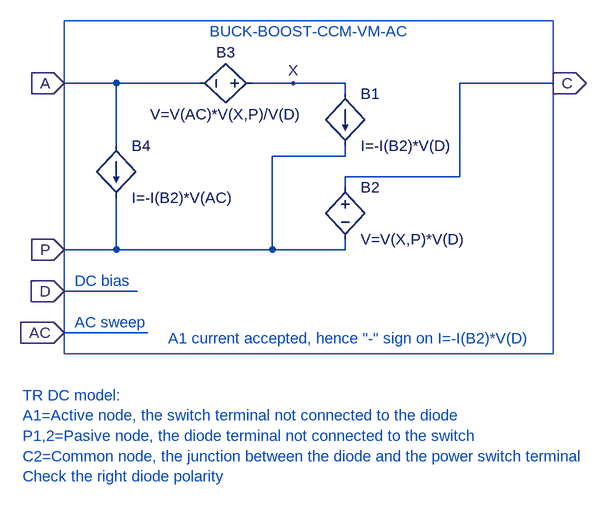
[diagram p0: schematic BUCK-BOOST-CCM-VM-AC.asc]
BUCK-BOOST-CCM-VM-AC.asc, the LTspice schematic file:
Version 4
SHEET 1 928 680
WIRE 96 -144 16 -144
WIRE 224 -144 96 -144
WIRE 368 -144 304 -144
WIRE 448 -144 368 -144
WIRE 768 -144 624 -144
WIRE 448 -128 448 -144
WIRE 96 -48 96 -144
WIRE 448 -32 448 -48
WIRE 448 -32 336 -32
WIRE 624 0 624 -144
WIRE 624 0 448 0
WIRE 448 16 448 0
WIRE 96 112 96 32
WIRE 96 112 16 112
WIRE 336 112 336 -32
WIRE 336 112 96 112
WIRE 448 112 448 96
WIRE 448 112 336 112
WIRE 128 176 16 176
WIRE 144 240 16 240
FLAG 16 -144 A
IOPIN 16 -144 In
FLAG 16 112 P
IOPIN 16 112 In
FLAG 768 -144 C
IOPIN 768 -144 Out
FLAG 16 176 D
IOPIN 16 176 In
FLAG 16 240 AC
IOPIN 16 240 In
FLAG 368 -144 X
SYMBOL bi 448 -128 R0
SYMATTR InstName B1
SYMATTR Value I=-I(B2)*V(D)
SYMBOL bv 448 0 R0
SYMATTR InstName B2
SYMATTR Value V=V(X,P)*V(D)
SYMBOL bv 320 -144 R90
WINDOW 0 -32 56 VBottom 0
WINDOW 3 32 56 VTop 0
SYMATTR InstName B3
SYMATTR Value V=V(AC)*V(X,P)/V(D)
SYMBOL bi 96 -48 R0
SYMATTR InstName B4
SYMATTR Value I=-I(B2)*V(AC)
TEXT 240 -224 Left 0 ;BUCK-BOOST-CCM-VM-AC
TEXT -48 336 Left 0 ;TR DC model:\nA1=Active node, the switch terminal not connected to the diode\nP1,2=Pasive node, the diode terminal not connected to the switch\nC2=Common node, the junction between the diode and the power switch terminal\nCheck the right diode polarity
TEXT 176 248 Left 0 ;A1 current accepted, hence "-" sign on I=-I(B2)*V(D)
TEXT 32 224 Left 0 ;AC sweep
TEXT 32 160 Left 0 ;DC bias
RECTANGLE Normal 768 272 16 -240

The netlist it stands for:
* BUCK-BOOST-CCM-VM-AC.asc
B1 X P I=-I(B2)*V(D)
B2 C P V=V(X,P)*V(D)
B3 X A V=V(AC)*V(X,P)/V(D)
B4 A P I=-I(B2)*V(AC)
* BUCK-BOOST-CCM-VM-AC
* TR DC model:
* A1=Active node, the switch terminal not connected to the diode
* P1,2=Pasive node, the diode terminal not connected to the switch
* C2=Common node, the junction between the diode and the power switch terminal
* Check the right diode polarity
* A1 current accepted, hence "-" sign on I=-I(B2)*V(D)
* AC sweep
* DC bias
.backanno
.end